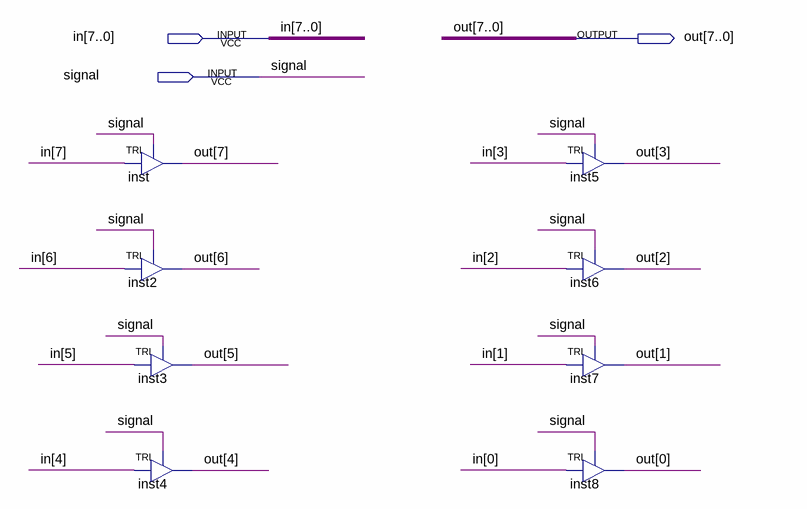
[diagram p0: schematic sheet]
// Quartus schematic TriStateBuff8.bdf as structural Verilog: 8 symbols, 3 pins
module TriStateBuff8 (
  input  [7:0] in,
  input  signal,
  output [7:0] out
);

  TRI inst (.IN(in[7]), .OE(signal), .OUT(out[7]));
  TRI inst2 (.IN(in[6]), .OE(signal), .OUT(out[6]));
  TRI inst3 (.IN(in[5]), .OE(signal), .OUT(out[5]));
  TRI inst4 (.IN(in[4]), .OE(signal), .OUT(out[4]));
  TRI inst5 (.IN(in[3]), .OE(signal), .OUT(out[3]));
  TRI inst6 (.IN(in[2]), .OE(signal), .OUT(out[2]));
  TRI inst7 (.IN(in[1]), .OE(signal), .OUT(out[1]));
  TRI inst8 (.IN(in[0]), .OE(signal), .OUT(out[0]));
endmodule
